# Altium schematic sheet Power.SchDoc
size A
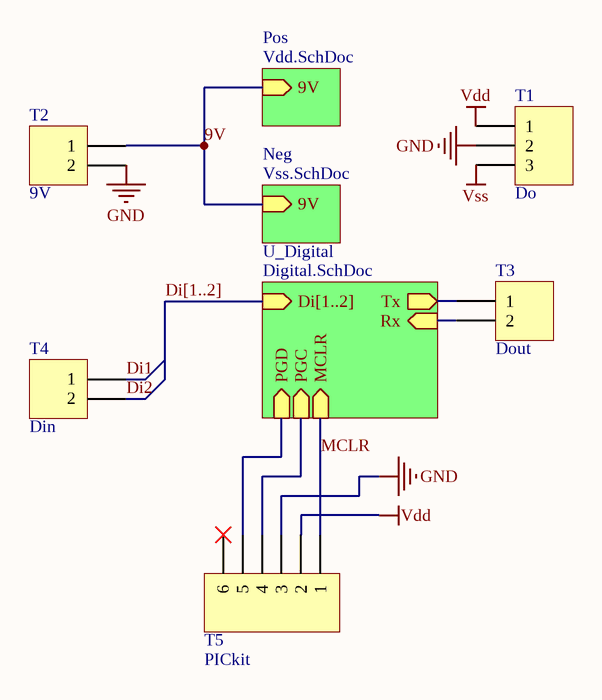
[diagram p0: Power.SchDoc]

## Parts
T1  Do  [HDR1X3]
T2  9V  [HDR1X2]
T3  Dout  [HDR1X2]
T4  Din  [HDR1X2]
T5  PICkit  [HDR1X6]

## Sub-sheets
Neg = Vss.SchDoc: 9V (in)
Pos = Vdd.SchDoc: 9V (in)
U_Digital = Digital.SchDoc: MCLR (in), Rx (in), Tx (out), PGD (in), PGC (in), Di[1..2] (in)

## Nets
GND: T1.2 T2.2 T5.3
Vdd: T1.1 T5.2
Vss: T1.3
9V: T2.1 ; sheet Pos/9V, sheet Neg/9V
Di1: T4.1
Di2: T4.2
MCLR: T5.1 ; sheet U_Digital/MCLR
NetT3_1: T3.1 ; sheet U_Digital/Tx
NetT3_2: T3.2 ; sheet U_Digital/Rx
NetT5_4: T5.4 ; sheet U_Digital/PGC
NetT5_5: T5.5 ; sheet U_Digital/PGD

Not connected (* = marked no-connect by the designer): T5 6*

## Buses and harness runs
bus Di[1..2] = sheet U_Digital/Di[1..2]

## Library data of the parts
T1 = Header 3: Header, 3-Pin; LatestRevisionDate: 17-Jul-2002; LatestRevisionNote: Re-released for DXP Platform.; Publisher: Altium Limited
T2-T4 = Header 2: Header, 2-Pin; LatestRevisionDate: 17-Jul-2002; LatestRevisionNote: Re-released for DXP Platform.; Publisher: Altium Limited
T5 = Header 6: Header, 6-Pin; LatestRevisionDate: 17-Jul-2002; LatestRevisionNote: Re-released for DXP Platform.; Publisher: Altium Limited